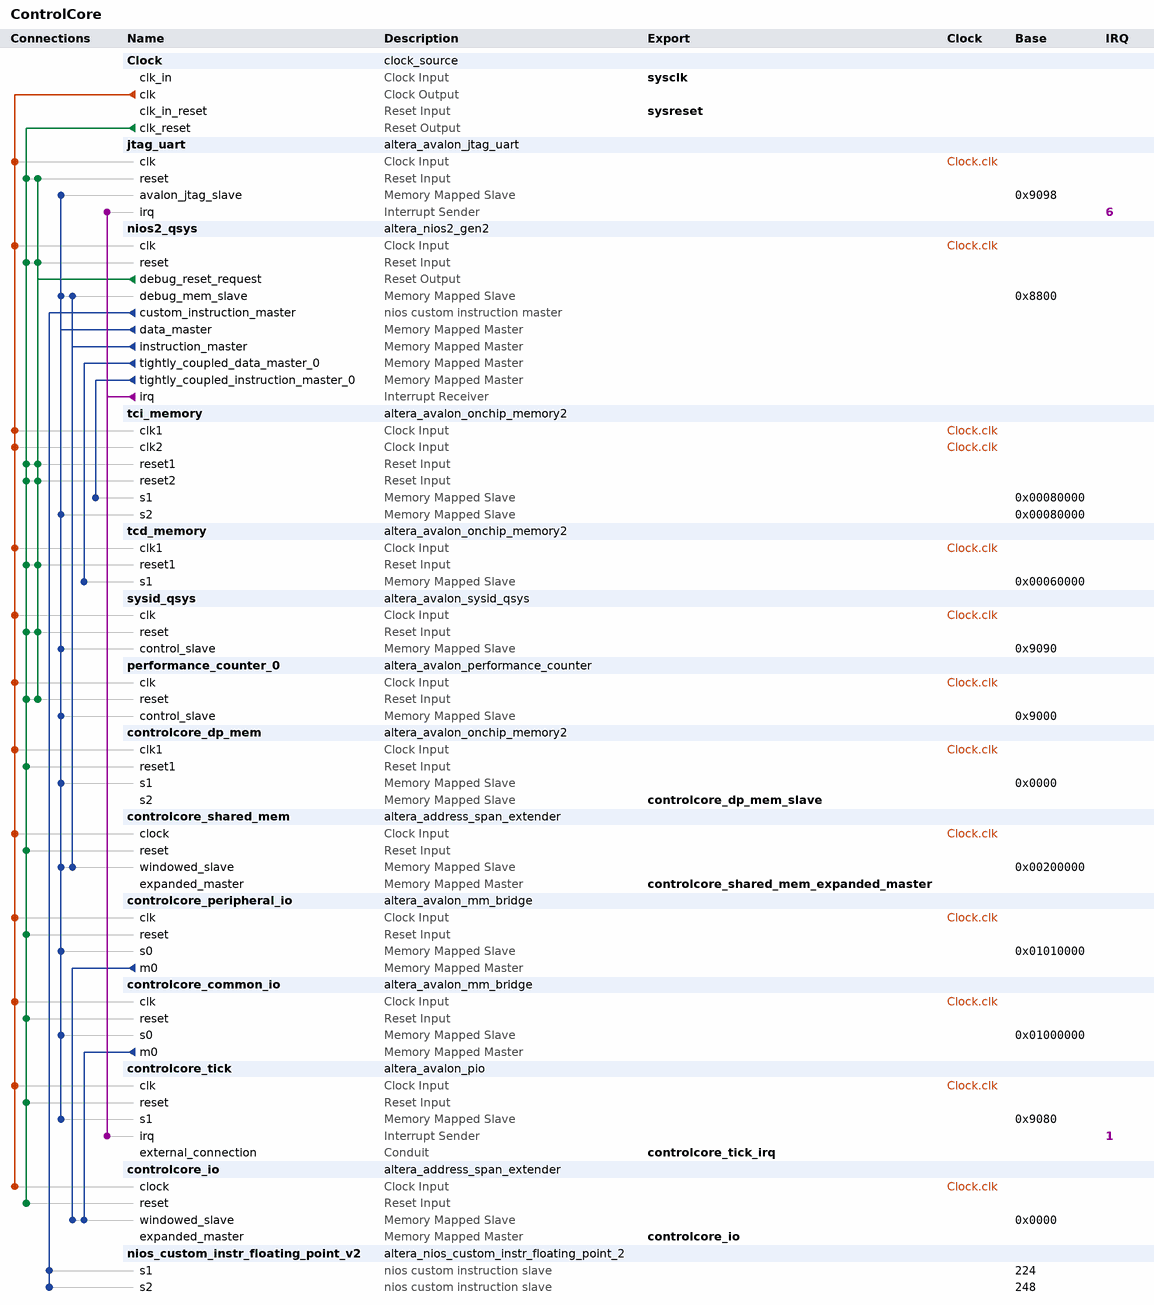
[diagram p0: system contents]
# Platform Designer (Qsys) system ControlCore, Cyclone V 5CSXFC6D6F31C6
# Parameters at their usual value, and those the tool derives, are not listed.
package require -exact qsys 18.1
create_system ControlCore
set_project_property DEVICE_FAMILY {Cyclone V}
set_project_property DEVICE 5CSXFC6D6F31C6

add_instance Clock clock_source 18.1
set_instance_parameter_value Clock clockFrequency 200000000

add_instance jtag_uart altera_avalon_jtag_uart 18.1
set_instance_parameter_value jtag_uart allowMultipleConnections true
set_instance_parameter_value jtag_uart simInteractiveOptions INTERACTIVE_INPUT_OUTPUT

add_instance nios2_qsys altera_nios2_gen2 18.1
set_instance_parameter_value nios2_qsys dcache_numTCDM 1
set_instance_parameter_value nios2_qsys dcache_size 2048
set_instance_parameter_value nios2_qsys dividerType srt2
set_instance_parameter_value nios2_qsys exceptionSlave tci_memory.s1
set_instance_parameter_value nios2_qsys icache_burstType Sequential
set_instance_parameter_value nios2_qsys icache_numTCIM 1
set_instance_parameter_value nios2_qsys icache_size 2048
set_instance_parameter_value nios2_qsys impl Fast
set_instance_parameter_value nios2_qsys io_regionbase 16777216
set_instance_parameter_value nios2_qsys io_regionsize 131072
set_instance_parameter_value nios2_qsys mul_64_impl 1
set_instance_parameter_value nios2_qsys mul_shift_choice 1
set_instance_parameter_value nios2_qsys resetSlave tci_memory.s1
set_instance_parameter_value nios2_qsys setting_activateTrace true
set_instance_parameter_value nios2_qsys setting_shadowRegisterSets 1

add_instance tci_memory altera_avalon_onchip_memory2 18.1
set_instance_parameter_value tci_memory dataWidth 32
set_instance_parameter_value tci_memory dualPort true
set_instance_parameter_value tci_memory initMemContent true
set_instance_parameter_value tci_memory initializationFileName tci_memory
set_instance_parameter_value tci_memory memorySize 16384

add_instance tcd_memory altera_avalon_onchip_memory2 18.1
set_instance_parameter_value tcd_memory dataWidth 32
set_instance_parameter_value tcd_memory dualPort false
set_instance_parameter_value tcd_memory initMemContent true
set_instance_parameter_value tcd_memory initializationFileName tcd_memory
set_instance_parameter_value tcd_memory memorySize 16384

add_instance sysid_qsys altera_avalon_sysid_qsys 18.1
set_instance_parameter_value sysid_qsys id 1638676

add_instance performance_counter_0 altera_avalon_performance_counter 18.1
set_instance_parameter_value performance_counter_0 numberOfSections 7

add_instance controlcore_dp_mem altera_avalon_onchip_memory2 18.1
set_instance_parameter_value controlcore_dp_mem dataWidth 32
set_instance_parameter_value controlcore_dp_mem dualPort true
set_instance_parameter_value controlcore_dp_mem initMemContent false
set_instance_parameter_value controlcore_dp_mem initializationFileName controlcore_dp_mem
set_instance_parameter_value controlcore_dp_mem memorySize 32768
set_instance_parameter_value controlcore_dp_mem readDuringWriteMode OLD_DATA
set_instance_parameter_value controlcore_dp_mem singleClockOperation true

add_instance controlcore_shared_mem altera_address_span_extender 18.1
set_instance_parameter_value controlcore_shared_mem BURSTCOUNT_WIDTH 2
set_instance_parameter_value controlcore_shared_mem DATA_WIDTH 32
set_instance_parameter_value controlcore_shared_mem ENABLE_SLAVE_PORT false
set_instance_parameter_value controlcore_shared_mem MASTER_ADDRESS_DEF 0
set_instance_parameter_value controlcore_shared_mem MASTER_ADDRESS_WIDTH 24
set_instance_parameter_value controlcore_shared_mem MAX_PENDING_READS 1
set_instance_parameter_value controlcore_shared_mem SLAVE_ADDRESS_WIDTH 18

add_instance controlcore_peripheral_io altera_avalon_mm_bridge 18.1
set_instance_parameter_value controlcore_peripheral_io ADDRESS_UNITS SYMBOLS
set_instance_parameter_value controlcore_peripheral_io ADDRESS_WIDTH 16
set_instance_parameter_value controlcore_peripheral_io DATA_WIDTH 32
set_instance_parameter_value controlcore_peripheral_io MAX_PENDING_RESPONSES 4
set_instance_parameter_value controlcore_peripheral_io USE_AUTO_ADDRESS_WIDTH 0

add_instance controlcore_common_io altera_avalon_mm_bridge 18.1
set_instance_parameter_value controlcore_common_io ADDRESS_UNITS SYMBOLS
set_instance_parameter_value controlcore_common_io ADDRESS_WIDTH 16
set_instance_parameter_value controlcore_common_io DATA_WIDTH 32
set_instance_parameter_value controlcore_common_io MAX_PENDING_RESPONSES 4
set_instance_parameter_value controlcore_common_io USE_AUTO_ADDRESS_WIDTH 0

add_instance controlcore_tick altera_avalon_pio 18.1
set_instance_parameter_value controlcore_tick captureEdge true
set_instance_parameter_value controlcore_tick direction Input
set_instance_parameter_value controlcore_tick generateIRQ true
set_instance_parameter_value controlcore_tick irqType EDGE
set_instance_parameter_value controlcore_tick width 1

add_instance controlcore_io altera_address_span_extender 18.1
set_instance_parameter_value controlcore_io BURSTCOUNT_WIDTH 1
set_instance_parameter_value controlcore_io DATA_WIDTH 32
set_instance_parameter_value controlcore_io ENABLE_SLAVE_PORT false
set_instance_parameter_value controlcore_io MASTER_ADDRESS_DEF 0
set_instance_parameter_value controlcore_io MASTER_ADDRESS_WIDTH 24
set_instance_parameter_value controlcore_io MAX_PENDING_READS 1
set_instance_parameter_value controlcore_io SLAVE_ADDRESS_WIDTH 14

add_instance nios_custom_instr_floating_point_v2 altera_nios_custom_instr_floating_point_2 18.1
set_instance_parameter_value nios_custom_instr_floating_point_v2 arithmetic_present true
set_instance_parameter_value nios_custom_instr_floating_point_v2 comparison_present true
set_instance_parameter_value nios_custom_instr_floating_point_v2 conversion_present true
set_instance_parameter_value nios_custom_instr_floating_point_v2 root_present true

# connections
add_connection Clock.clk controlcore_common_io.clk clock
add_connection Clock.clk controlcore_dp_mem.clk1 clock
add_connection Clock.clk controlcore_io.clock clock
add_connection Clock.clk controlcore_peripheral_io.clk clock
add_connection Clock.clk controlcore_shared_mem.clock clock
add_connection Clock.clk controlcore_tick.clk clock
add_connection Clock.clk jtag_uart.clk clock
add_connection Clock.clk nios2_qsys.clk clock
add_connection Clock.clk performance_counter_0.clk clock
add_connection Clock.clk sysid_qsys.clk clock
add_connection Clock.clk tcd_memory.clk1 clock
add_connection Clock.clk tci_memory.clk1 clock
add_connection Clock.clk tci_memory.clk2 clock
add_connection Clock.clk_reset controlcore_common_io.reset reset
add_connection Clock.clk_reset controlcore_dp_mem.reset1 reset
add_connection Clock.clk_reset controlcore_io.reset reset
add_connection Clock.clk_reset controlcore_peripheral_io.reset reset
add_connection Clock.clk_reset controlcore_shared_mem.reset reset
add_connection Clock.clk_reset controlcore_tick.reset reset
add_connection Clock.clk_reset jtag_uart.reset reset
add_connection Clock.clk_reset nios2_qsys.reset reset
add_connection Clock.clk_reset performance_counter_0.reset reset
add_connection Clock.clk_reset sysid_qsys.reset reset
add_connection Clock.clk_reset tcd_memory.reset1 reset
add_connection Clock.clk_reset tci_memory.reset1 reset
add_connection Clock.clk_reset tci_memory.reset2 reset
add_connection nios2_qsys.debug_reset_request jtag_uart.reset reset
add_connection nios2_qsys.debug_reset_request nios2_qsys.reset reset
add_connection nios2_qsys.debug_reset_request performance_counter_0.reset reset
add_connection nios2_qsys.debug_reset_request sysid_qsys.reset reset
add_connection nios2_qsys.debug_reset_request tcd_memory.reset1 reset
add_connection nios2_qsys.debug_reset_request tci_memory.reset1 reset
add_connection nios2_qsys.debug_reset_request tci_memory.reset2 reset
add_connection controlcore_common_io.m0 controlcore_io.windowed_slave avalon
set_connection_parameter_value controlcore_common_io.m0/controlcore_io.windowed_slave baseAddress 0x0000
add_connection controlcore_peripheral_io.m0 controlcore_io.windowed_slave avalon
set_connection_parameter_value controlcore_peripheral_io.m0/controlcore_io.windowed_slave baseAddress 0x0000
add_connection nios2_qsys.data_master controlcore_common_io.s0 avalon
set_connection_parameter_value nios2_qsys.data_master/controlcore_common_io.s0 baseAddress 0x01000000
add_connection nios2_qsys.data_master controlcore_dp_mem.s1 avalon
set_connection_parameter_value nios2_qsys.data_master/controlcore_dp_mem.s1 baseAddress 0x0000
add_connection nios2_qsys.data_master controlcore_peripheral_io.s0 avalon
set_connection_parameter_value nios2_qsys.data_master/controlcore_peripheral_io.s0 baseAddress 0x01010000
add_connection nios2_qsys.data_master controlcore_shared_mem.windowed_slave avalon
set_connection_parameter_value nios2_qsys.data_master/controlcore_shared_mem.windowed_slave baseAddress 0x00200000
add_connection nios2_qsys.data_master controlcore_tick.s1 avalon
set_connection_parameter_value nios2_qsys.data_master/controlcore_tick.s1 baseAddress 0x9080
add_connection nios2_qsys.data_master jtag_uart.avalon_jtag_slave avalon
set_connection_parameter_value nios2_qsys.data_master/jtag_uart.avalon_jtag_slave baseAddress 0x9098
add_connection nios2_qsys.data_master nios2_qsys.debug_mem_slave avalon
set_connection_parameter_value nios2_qsys.data_master/nios2_qsys.debug_mem_slave baseAddress 0x8800
add_connection nios2_qsys.data_master performance_counter_0.control_slave avalon
set_connection_parameter_value nios2_qsys.data_master/performance_counter_0.control_slave baseAddress 0x9000
add_connection nios2_qsys.data_master sysid_qsys.control_slave avalon
set_connection_parameter_value nios2_qsys.data_master/sysid_qsys.control_slave baseAddress 0x9090
add_connection nios2_qsys.data_master tci_memory.s2 avalon
set_connection_parameter_value nios2_qsys.data_master/tci_memory.s2 baseAddress 0x00080000
add_connection nios2_qsys.instruction_master controlcore_shared_mem.windowed_slave avalon
set_connection_parameter_value nios2_qsys.instruction_master/controlcore_shared_mem.windowed_slave baseAddress 0x00200000
add_connection nios2_qsys.instruction_master nios2_qsys.debug_mem_slave avalon
set_connection_parameter_value nios2_qsys.instruction_master/nios2_qsys.debug_mem_slave baseAddress 0x8800
add_connection nios2_qsys.tightly_coupled_data_master_0 tcd_memory.s1 avalon
set_connection_parameter_value nios2_qsys.tightly_coupled_data_master_0/tcd_memory.s1 baseAddress 0x00060000
add_connection nios2_qsys.tightly_coupled_instruction_master_0 tci_memory.s1 avalon
set_connection_parameter_value nios2_qsys.tightly_coupled_instruction_master_0/tci_memory.s1 baseAddress 0x00080000
add_connection nios2_qsys.irq controlcore_tick.irq interrupt
set_connection_parameter_value nios2_qsys.irq/controlcore_tick.irq irqNumber 1
add_connection nios2_qsys.irq jtag_uart.irq interrupt
set_connection_parameter_value nios2_qsys.irq/jtag_uart.irq irqNumber 6
add_connection nios2_qsys.custom_instruction_master nios_custom_instr_floating_point_v2.s1 nios_custom_instruction
set_connection_parameter_value nios2_qsys.custom_instruction_master/nios_custom_instr_floating_point_v2.s1 CIName nios_custom_instr_floating_point_v2
set_connection_parameter_value nios2_qsys.custom_instruction_master/nios_custom_instr_floating_point_v2.s1 baseAddress 224
add_connection nios2_qsys.custom_instruction_master nios_custom_instr_floating_point_v2.s2 nios_custom_instruction
set_connection_parameter_value nios2_qsys.custom_instruction_master/nios_custom_instr_floating_point_v2.s2 CIName nios_custom_instr_floating_point_v2_1
set_connection_parameter_value nios2_qsys.custom_instruction_master/nios_custom_instr_floating_point_v2.s2 baseAddress 248

# exported interfaces
add_interface controlcore_dp_mem_slave avalon slave
set_interface_property controlcore_dp_mem_slave EXPORT_OF controlcore_dp_mem.s2
add_interface controlcore_io avalon master
set_interface_property controlcore_io EXPORT_OF controlcore_io.expanded_master
add_interface controlcore_shared_mem_expanded_master avalon master
set_interface_property controlcore_shared_mem_expanded_master EXPORT_OF controlcore_shared_mem.expanded_master
add_interface controlcore_tick_irq conduit end
set_interface_property controlcore_tick_irq EXPORT_OF controlcore_tick.external_connection
add_interface sysclk clock sink
set_interface_property sysclk EXPORT_OF Clock.clk_in
add_interface sysreset reset sink
set_interface_property sysreset EXPORT_OF Clock.clk_in_reset

set_interconnect_requirement {$system} qsys_mm.clockCrossingAdapter HANDSHAKE
set_interconnect_requirement {$system} qsys_mm.maxAdditionalLatency 1

save_system ControlCore.qsys
